# EAGLE design AeroQuad_v300 (EAGLE 6.4)
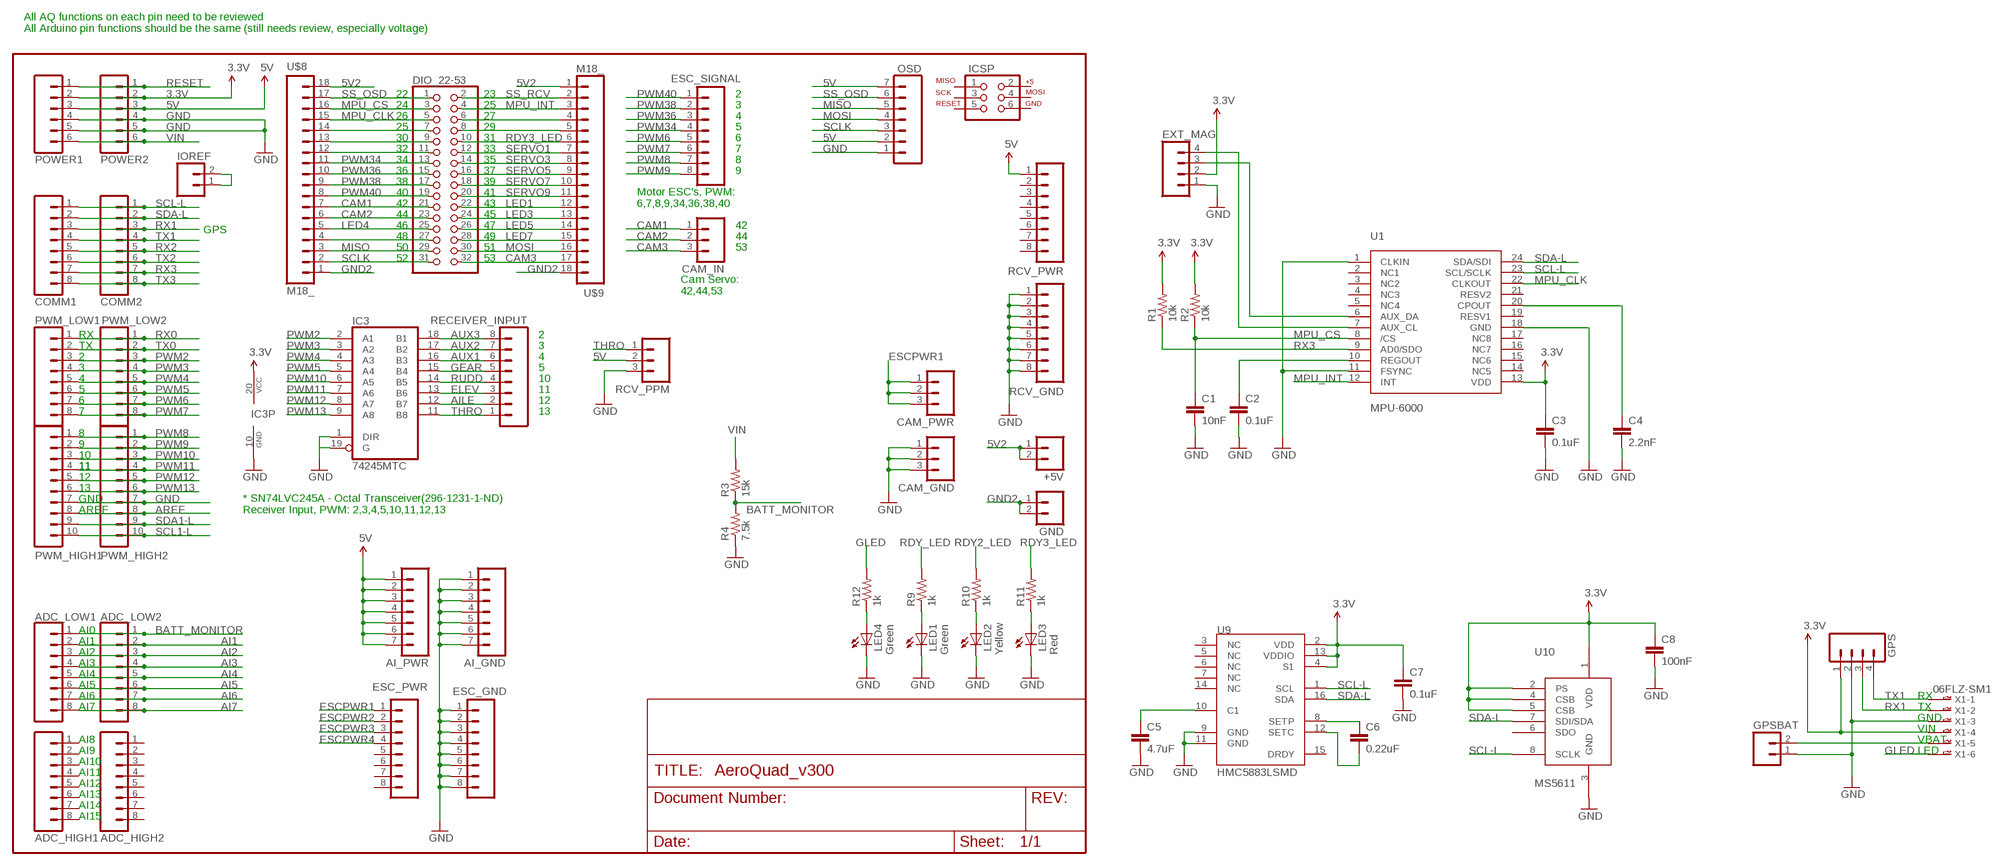
[diagram p0: schematic, sheet 1]

## Parts
+5V  M02PTH  [1X02]
ADC_HIGH1  M08LOCK  [1X08_LOCK]
ADC_HIGH2  M08LOCK  [1X08_LOCK]
ADC_LOW1  M08LOCK  [1X08_LOCK]
ADC_LOW2  M08LOCK  [1X08_LOCK]
AI_GND  M07  [1X07]
AI_PWR  M07  [1X07]
C1  10nF  CAP0402-CAP  [0402-CAP]
C2  0.1uF  CAP0402-CAP  [0402-CAP]
C3  0.1uF  CAP0402-CAP  [0402-CAP]
C4  2.2nF  CAP0402-CAP  [0402-CAP]
C5  4.7uF  CAP0402-CAP  [0402-CAP]
C6  0.22uF  CAP0402-CAP  [0402-CAP]
C7  0.1uF  CAP0402-CAP  [0402-CAP]
C8  100nF  CAP0402-CAP  [0402-CAP]
CAM_GND  M03LOCK  [1X03_LOCK]
CAM_IN  M03LOCK  [1X03_LOCK]
CAM_PWR  M03LOCK  [1X03_LOCK]
COMM1  M08LOCK  [1X08_LOCK]
COMM2  M08LOCK  [1X08_LOCK]
DIO_22-53  PINHD-2X16  [2X16]
ESC_GND  M11LOCK  M08LOCK  [1X08_LOCK]
ESC_PWR  M11LOCK  M08LOCK  [1X08_LOCK]
ESC_SIGNAL  M11LOCK  M08LOCK  [1X08_LOCK]
EXT_MAG  M04LOCK  [1X04_LOCK]
GND  M02PTH  [1X02]
GPS  M04LOCK  [1X04_LOCK]
GPSBAT  M02PTH  [1X02]
IC3  74245MTC  [SSOP20]
ICSP  AVR_SPI_PRG_6NS  [2X3-NS]
IOREF  M02LOCK  [1X02_LOCK]
LED1  Green  LED0603  [LED-0603]
LED2  Yellow  LED0603  [LED-0603]
LED3  Red  LED0603  [LED-0603]
LED4  Green  LED0603  [LED-0603]
OSD  M07LOCK  [1X07_LOCK]
POWER1  M06LOCK  [1X06_LOCK]
POWER2  M06LOCK  [1X06_LOCK]
PWM_HIGH1  M10LOCK  [1X10_LOCK]
PWM_HIGH2  M10LOCK  [1X10_LOCK]
PWM_LOW1  M08LOCK  [1X08_LOCK]
PWM_LOW2  M08LOCK  [1X08_LOCK]
R1  10k  RESISTOR0402-RES  [0402-RES]
R2  10k  RESISTOR0402-RES  [0402-RES]
R3  15k  RESISTOR0402-RES  [0402-RES]
R4  7.5k  RESISTOR0402-RES  [0402-RES]
R9  1k  RESISTOR0402-RES  [0402-RES]
R10  1k  RESISTOR0402-RES  [0402-RES]
R11  1k  RESISTOR0402-RES  [0402-RES]
R12  1k  RESISTOR0402-RES  [0402-RES]
RCV_GND  M10LOCK  M08LOCK  [1X08_LOCK]
RCV_PPM  M03LOCK  [1X03_LOCK]
RCV_PWR  M10LOCK  M08LOCK  [1X08_LOCK]
RECEIVER_INPUT  M08LOCK  [1X08_LOCK]
U1  MPU-6000  [QFN-24]
U9  HMC5883LSMD  [16LPCC]
U10  MS5611  [LGA08A]
U$8  M18_  [1X18]
U$9  M18_  [1X18]
X1  06FLZ-SM1  [6FLZ-SM]

## Nets
3.3V: C3.1 C7.1 C8.1 EXT_MAG.2 GPS.1 IC3.20(VCC) POWER1.2 POWER2.2 R1.2 R2.2 U1.13(VDD) U9.2(VDD) U9.4(S1) U9.13(VDDIO) U10.1(VDD) U10.2(PS) U10.4(CSB) U10.5(CSB) X1.4
5V: AI_PWR.1 AI_PWR.2 AI_PWR.3 AI_PWR.4 AI_PWR.5 AI_PWR.6 AI_PWR.7 OSD.2 OSD.7 POWER1.3 POWER2.3 RCV_PPM.2 RCV_PWR.1
5V2: +5V.1 +5V.2 U$8.18 U$9.1
AI1: ADC_LOW1.2 ADC_LOW2.2
AI2: ADC_LOW1.3 ADC_LOW2.3
AI3: ADC_LOW1.4 ADC_LOW2.4
AI4: ADC_LOW1.5 ADC_LOW2.5
AI5: ADC_LOW1.6 ADC_LOW2.6
AI6: ADC_LOW1.7 ADC_LOW2.7
AI7: ADC_LOW1.8 ADC_LOW2.8
AILE: IC3.12(B7) RECEIVER_INPUT.2
AREF: PWM_HIGH1.8 PWM_HIGH2.8
AUX1: IC3.16(B3) RECEIVER_INPUT.6
AUX2: IC3.17(B2) RECEIVER_INPUT.7
AUX3: IC3.18(B1) RECEIVER_INPUT.8
BATT_MONITOR: ADC_LOW1.1 ADC_LOW2.1 R3.1 R4.2
CAM1: CAM_IN.1 DIO_22-53.21 U$8.7
CAM2: CAM_IN.2 DIO_22-53.23 U$8.6
CAM3: CAM_IN.3 DIO_22-53.32 U$9.17
ELEV: IC3.13(B6) RECEIVER_INPUT.3
ESCPWR1: CAM_PWR.1 CAM_PWR.2 CAM_PWR.3 ESC_PWR.1
ESCPWR2: ESC_PWR.2
ESCPWR3: ESC_PWR.3
ESCPWR4: ESC_PWR.4
GEAR: IC3.15(B4) RECEIVER_INPUT.5
GLED: R12.2 X1.6
GND: AI_GND.1 AI_GND.2 AI_GND.3 AI_GND.4 AI_GND.5 AI_GND.6 AI_GND.7 C1.2 C2.2 C3.2 C4.2 C5.2 C7.2 C8.2 CAM_GND.1 CAM_GND.2 CAM_GND.3 ESC_GND.1 ESC_GND.2 ESC_GND.3 ESC_GND.4 ESC_GND.5 ESC_GND.6 ESC_GND.7 ESC_GND.8 EXT_MAG.1 GPS.2 GPSBAT.1 IC3.1(DIR) IC3.10(GND) IC3.19(G) LED1.C LED2.C LED3.C LED4.C OSD.1 POWER1.4 POWER1.5 POWER2.4 POWER2.5 PWM_HIGH1.7 PWM_HIGH2.7 R4.1 RCV_GND.1 RCV_GND.2 RCV_GND.3 RCV_GND.4 RCV_GND.5 RCV_GND.6 RCV_GND.7 RCV_GND.8 RCV_PPM.3 U1.1(CLKIN) U1.11(FSYNC) U1.18(GND) U9.9(GND) U9.11(GND) U10.3(GND) X1.3
GND2: GND.1 GND.2 U$8.1 U$9.18
LED1: DIO_22-53.22 U$9.12
LED3: DIO_22-53.24 U$9.13
LED4: DIO_22-53.25 U$8.5
LED5: DIO_22-53.26 U$9.14
LED7: DIO_22-53.28 U$9.15
MISO: DIO_22-53.29 OSD.5 U$8.3
MOSI: DIO_22-53.30 OSD.4 U$9.16
MPU_CLK: DIO_22-53.5 U1.22(CLKOUT) U$8.15
MPU_CS: C1.1 DIO_22-53.3 R2.1 U1.8(/CS) U$8.16
MPU_INT: DIO_22-53.4 U1.12(INT) U$9.3
N$1: DIO_22-53.11 U$8.12
N$2: DIO_22-53.9 U$8.13
N$3: DIO_22-53.7 U$8.14
N$4: LED4.A R12.1
N$5: DIO_22-53.27 U$8.4
N$8: GPSBAT.2 X1.5
N$10: LED1.A R9.1
N$11: LED2.A R10.1
N$12: LED3.A R11.1
N$13: C5.1 U9.10(C1)
N$14: EXT_MAG.4 U1.7(AUX_CL)
N$15: EXT_MAG.3 U1.6(AUX_DA)
N$17: IOREF.1 IOREF.2
N$20: C6.1 U9.8(SETP)
N$22: C6.2 U9.12(SETC)
N$33: C2.1 U1.10(REGOUT)
N$37: DIO_22-53.6 U$9.4
N$38: DIO_22-53.8 U$9.5
N$40: C4.1 U1.20(CPOUT)
PWM2: IC3.2(A1) PWM_LOW1.3 PWM_LOW2.3
PWM3: IC3.3(A2) PWM_LOW1.4 PWM_LOW2.4
PWM4: IC3.4(A3) PWM_LOW1.5 PWM_LOW2.5
PWM5: IC3.5(A4) PWM_LOW1.6 PWM_LOW2.6
PWM6: ESC_SIGNAL.5 PWM_LOW1.7 PWM_LOW2.7
PWM7: ESC_SIGNAL.6 PWM_LOW1.8 PWM_LOW2.8
PWM8: ESC_SIGNAL.7 PWM_HIGH1.1 PWM_HIGH2.1
PWM9: ESC_SIGNAL.8 PWM_HIGH1.2 PWM_HIGH2.2
PWM10: IC3.6(A5) PWM_HIGH1.3 PWM_HIGH2.3
PWM11: IC3.7(A6) PWM_HIGH1.4 PWM_HIGH2.4
PWM12: IC3.8(A7) PWM_HIGH1.5 PWM_HIGH2.5
PWM13: IC3.9(A8) PWM_HIGH1.6 PWM_HIGH2.6
PWM34: DIO_22-53.13 ESC_SIGNAL.4 U$8.11
PWM36: DIO_22-53.15 ESC_SIGNAL.3 U$8.10
PWM38: DIO_22-53.17 ESC_SIGNAL.2 U$8.9
PWM40: DIO_22-53.19 ESC_SIGNAL.1 U$8.8
RDY2_LED: R10.2
RDY3_LED: DIO_22-53.10 R11.2 U$9.6
RDY_LED: R9.2
RESET: POWER1.1 POWER2.1
RUDD: IC3.14(B5) RECEIVER_INPUT.4
RX0: PWM_LOW1.1 PWM_LOW2.1
RX1: COMM1.3 COMM2.3 GPS.3 X1.2
RX2: COMM1.5 COMM2.5
RX3: COMM1.7 COMM2.7 R1.1 U1.9(AD0/SDO)
SCL1-L: PWM_HIGH1.10 PWM_HIGH2.10
SCL-L: COMM1.1 COMM2.1 U1.23(SCL/SCLK) U9.1(SCL) U10.8(SCLK)
SCLK: DIO_22-53.31 OSD.3 U$8.2
SDA1-L: PWM_HIGH1.9 PWM_HIGH2.9
SDA-L: COMM1.2 COMM2.2 U1.24(SDA/SDI) U9.16(SDA) U10.7(SDI/SDA)
SERVO1: DIO_22-53.12 U$9.7
SERVO3: DIO_22-53.14 U$9.8
SERVO5: DIO_22-53.16 U$9.9
SERVO7: DIO_22-53.18 U$9.10
SERVO9: DIO_22-53.20 U$9.11
SS_OSD: DIO_22-53.1 OSD.6 U$8.17
SS_RCV: DIO_22-53.2 U$9.2
THRO: IC3.11(B8) RCV_PPM.1 RECEIVER_INPUT.1
TX0: PWM_LOW1.2 PWM_LOW2.2
TX1: COMM1.4 COMM2.4 GPS.4 X1.1
TX2: COMM1.6 COMM2.6
TX3: COMM1.8 COMM2.8
VIN: POWER1.6 POWER2.6 R3.2
Unconnected: ADC_HIGH1.1 ADC_HIGH1.2 ADC_HIGH1.3 ADC_HIGH1.4 ADC_HIGH1.5 ADC_HIGH1.6 ADC_HIGH1.7 ADC_HIGH1.8 ADC_HIGH2.1 ADC_HIGH2.2 ADC_HIGH2.3 ADC_HIGH2.4 ADC_HIGH2.5 ADC_HIGH2.6 ADC_HIGH2.7 ADC_HIGH2.8 ESC_PWR.5 ESC_PWR.6 ESC_PWR.7 ESC_PWR.8 ICSP.1 ICSP.2 ICSP.3 ICSP.4 ICSP.5 ICSP.6 RCV_PWR.2 RCV_PWR.3 RCV_PWR.4 RCV_PWR.5 RCV_PWR.6 RCV_PWR.7 RCV_PWR.8 U1.2(NC1) U1.3(NC2) U1.4(NC3) U1.5(NC4) U1.14(NC5) U1.15(NC6) U1.16(NC7) U1.17(NC8) U1.19(RESV1) U1.21(RESV2) U9.3(NC) U9.5(NC) U9.6(NC) U9.7(NC) U9.14(NC) U9.15(DRDY) U10.6(SDO)

## Notes on the sheet
- All AQ functions on each pin need to be reviewed
  All Arduino pin functions should be the same (still needs review, especially voltage)
- 22 | 23 | 2
- 24 | 25 | 3
- 26 | 27 | 4
- 25 | 29 | 5
- 30 | 31 | 6
- 32 | 33 | 7
- 34 | 35 | 8
- 36 | 37 | 9
- 38 | 39
- 40 | 41
- 42 | 43
- Motor ESC's, PWM:
  6,7,8,9,34,36,38,40
- 44 | 45
- 46 | 47 | 42
- GPS
- 48 | 49 | 44
- 50 | 51 | 53
- 52 | 53
- Cam Servo:
  42,44,53
- RX | 2
- TX | 3
- 2 | 4
- 3 | 5
- 4 | 10
- 5 | 11
- 6 | 12
- 7 | 13
- 8
- 9
- 10
- 11 | 11
- 12
- 13
- GND
- AREF
- * SN74LVC245A - Octal Transceiver(296-1231-1-ND)
  Receiver Input, PWM: 2,3,4,5,10,11,12,13
- AI0
- AI1
- AI2
- AI3
- AI4
- AI5
- AI6 | RX
- AI7 | TX
- GND
- VIN
- AI8 | VBAT
- AI9 | LED
- AI10
- AI11
- AI12
- AI13
- AI14
- AI15

## Library data of the parts
+5V GND GPSBAT IOREF = SparkFun:M02: Header 2 Standard 2-pin 0.1" header. Use with straight break away headers (SKU : PRT-00116), right angle break away headers (PRT-00553), swiss pins (PRT-00743), machine pins (PRT-00117), and female headers (PRT-00115). Molex polarized connector foot print use with SKU : PRT-08233 with associated crimp pins and housings.
ADC_HIGH1 ADC_HIGH2 ADC_LOW1 ADC_LOW2 COMM1 COMM2 ESC_GND ESC_PWR ESC_SIGNAL PWM_LOW1 PWM_LOW2 RCV_GND RCV_PWR RECEIVER_INPUT = SparkFun:M08: Header 8 Standard 8-pin 0.1" header. Use with straight break away headers (SKU : PRT-00116), right angle break away headers (PRT-00553), swiss pins (PRT-00743), machine pins (PRT-00117), and female headers (PRT-00115).
AI_GND AI_PWR OSD = SparkFun:M07: Header 7 Standard 7-pin 0.1" header. Use with straight break away headers (SKU : PRT-00116), right angle break away headers (PRT-00553), swiss pins (PRT-00743), machine pins (PRT-00117), and female headers (PRT-00115). NOTES ON THE VARIANTS LOCK and LOCK_LONGPADS... This footprint was designed to help hold the alignment of a through-hole component (i.e. 7-pin header) while soldering it into place. You may notice that each hole has been shifted either up or down by 0.005 of an inch from it's more standard position (which is usually a perfectly straight line). This slight alteration caused the pins (the squares in the middle) to touch the edges of the holes. Because they are alternating, it causes a "brace" to hold the header in place. 0.005 has proven to be the perfect amount of "off-center" position when using our standard breakaway headers. Although looks a little odd when you look at the bare footprint, once you have a header in there, the alteration is very hard to notice. Also, if you push a header all the way into place, it is covered up entirely on the bottom side. This idea of altering the position of holes to aid alignment will be further integrated into the Sparkfun Library for other footprints. It can help hold any component with 3 or more connection pins.
C1-C8 = SparkFun:CAP: Capacitor Standard 0603 ceramic capacitor, and 0.1" leaded capacitor.
CAM_GND CAM_IN CAM_PWR RCV_PPM = SparkFun:M03: Header 3 Standard 3-pin 0.1" header. Use with straight break away headers (SKU : PRT-00116), right angle break away headers (PRT-00553), swiss pins (PRT-00743), machine pins (PRT-00117), and female headers (PRT-00115). Molex polarized connector foot print use with SKU : PRT-08232 with associated crimp pins and housings.
DIO_22-53 = pinhead:PINHD-2X16: PIN HEADER
EXT_MAG GPS = SparkFun:M04: Header 4 Standard 4-pin 0.1" header. Use with straight break away headers (SKU : PRT-00116), right angle break away headers (PRT-00553), swiss pins (PRT-00743), machine pins (PRT-00117), and female headers (PRT-00115). Molex polarized connector foot print use with SKU : PRT-08231 with associated crimp pins and housings. 1MM SMD Version SKU: PRT-10208
IC3 = adafruit:74*245: Octal BUS TRANSCEIVER, 3-state
ICSP = SparkFun:AVR_SPI_PRG_6: AVR ISP 6 Pin This is the reduced ISP connector for AVR programming. Common on Arduino. This footprint will take up less PCB space and can be used with a 10-pin to 6-pin adapter such as SKU: BOB-08508
LED1-LED4 = SparkFun:LED: LEDs Standard schematic elements and footprints for 5mm, 3mm, 1206, and 0603 sized LEDs. 5mm - Spark Fun Electronics SKU : COM-00529 (and others)
POWER1 POWER2 = SparkFun:M06: Header 6 Standard 6-pin 0.1" header. Use with straight break away headers (SKU : PRT-00116), right angle break away headers (PRT-00553), swiss pins (PRT-00743), machine pins (PRT-00117), and female headers (PRT-00115). Molex polarized connector foot print use with SKU : PRT-08094 with associated crimp pins and housings. NOTES ON THE VARIANTS LOCK and LOCK_LONGPADS... This footprint was designed to help hold the alignment of a through-hole component (i.e. 6-pin header) while soldering it into place. You may notice that each hole has been shifted either up or down by 0.005 of an inch from it's more standard position (which is a perfectly straight line). This slight alteration caused the pins (the squares in the middle) to touch the edges of the holes. Because they are alternating, it causes a "brace" to hold the component in place. 0.005 has proven to be the perfect amount of "off-center" position when using our standard breakaway headers. Although looks a little odd when you look at the bare footprint, once you have a header in there, the alteration is very hard to notice. Also, if you push a header all the way into place, it is covered up entirely on the bottom side. This idea of altering the position of holes to aid alignment will be further integrated into the Sparkfun Library for other footprints. It can help hold any component with 3 or more connection pins.
PWM_HIGH1 PWM_HIGH2 = SparkFun:M10: Header 10 Standard 10-pin 0.1" header. Use with straight break away headers (SKU : PRT-00116), right angle break away headers (PRT-00553), swiss pins (PRT-00743), machine pins (PRT-00117), and female headers (PRT-00115).
R1-R4 R9-R12 = SparkFun:RESISTOR: Resistor Basic schematic elements and footprints for 0603, 1206, and PTH resistors.
U1 = 3DRobotics_Master_Library:MPU-6000: Invensense MPU-6000: 3-axis gyro, 3-axis accel & 9-axis MotionFusion The MPU-60X0 Motion Processing Unit (MPU?) is the world?s first motion processing solution with integrated 9-axis sensor fusion for handset and tablet applications, game controllers, motion pointer remote controls, and other consumer devices. The MPU-60X0 has an embedded 3-axis MEMS gyroscope, 3-axis MEMS accelerometer and Digital Motion Processor? (DMP) hardware accelerator engine with an auxiliary I 2 C port that interfaces to third party digital sensors, such as magnetometers. Interfacing with a 3-axis magnetometer delivers a complete 9-axis sensor fusion output to the MPU?s primary I 2 C or SPI port. (SPI is available on MPU-6000 only). This combines acceleration and rotational motion plus heading information into a single data stream for the application; DATASHEET: http://invensense.com/mems/gyro/documents/PS-MPU-6000A-00_v1.0.pdf; LINK: http://invensense.com/mems/gyro/mpu6000.html; MFGPN: MPU-6000
U9 = SparkFun:HMC5883L: 3 Axis Digital Compass IC
U10 = DSP-TI:MS5611: Pressure sensor 10cm
U$8 U$9 = SparkFun:M18
X1 = con-jst:06FLZ-SM1: CONNECTOR; OC_FARNELL: unknown; OC_NEWARK: unknown

## Net classes
0 default: width 0.203 mm
1 vcc: width 0.254 mm

## Board
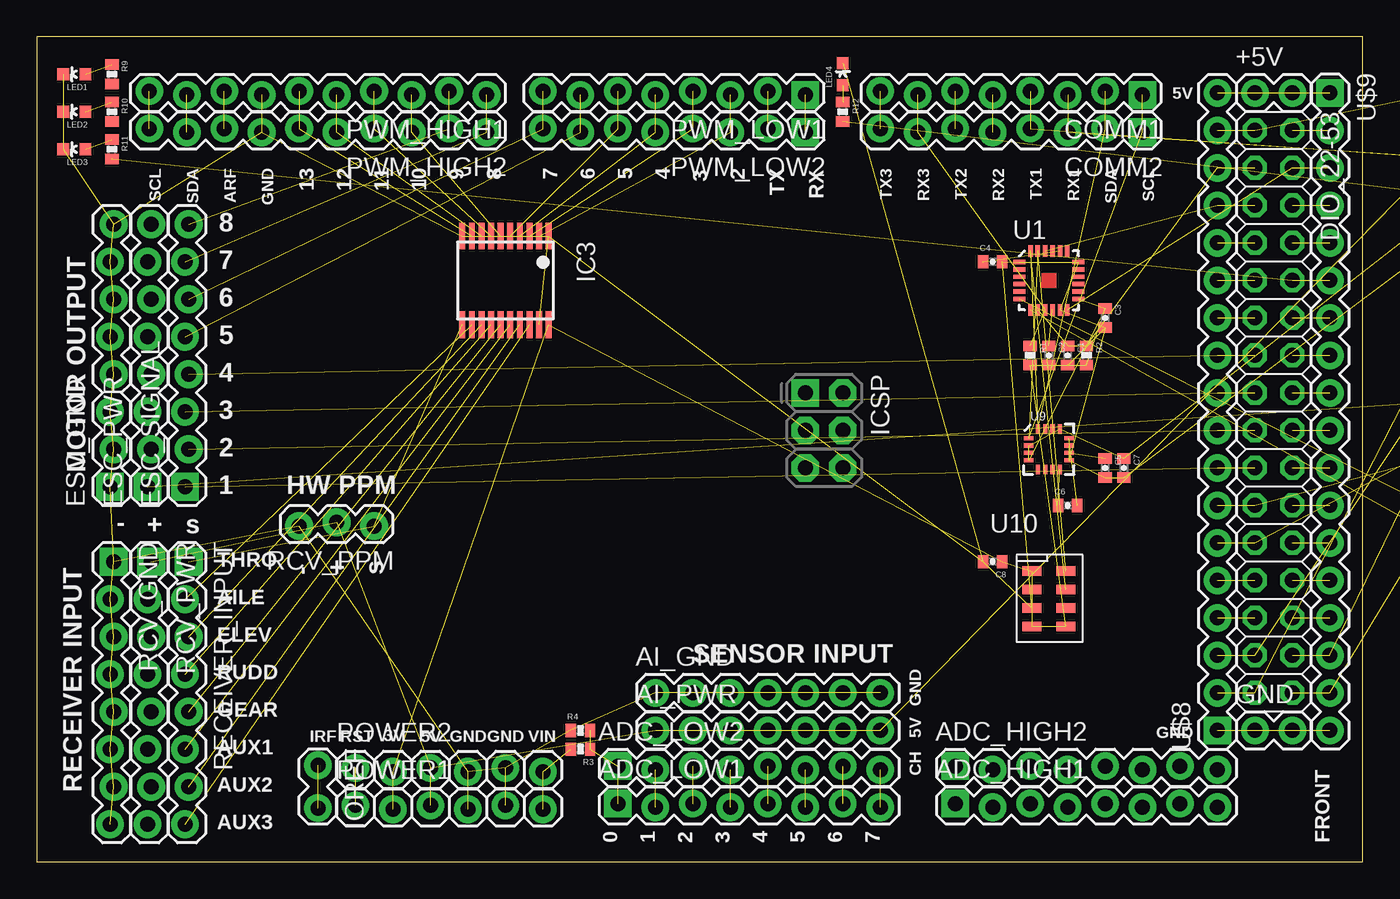
[diagram p1: board, top side]
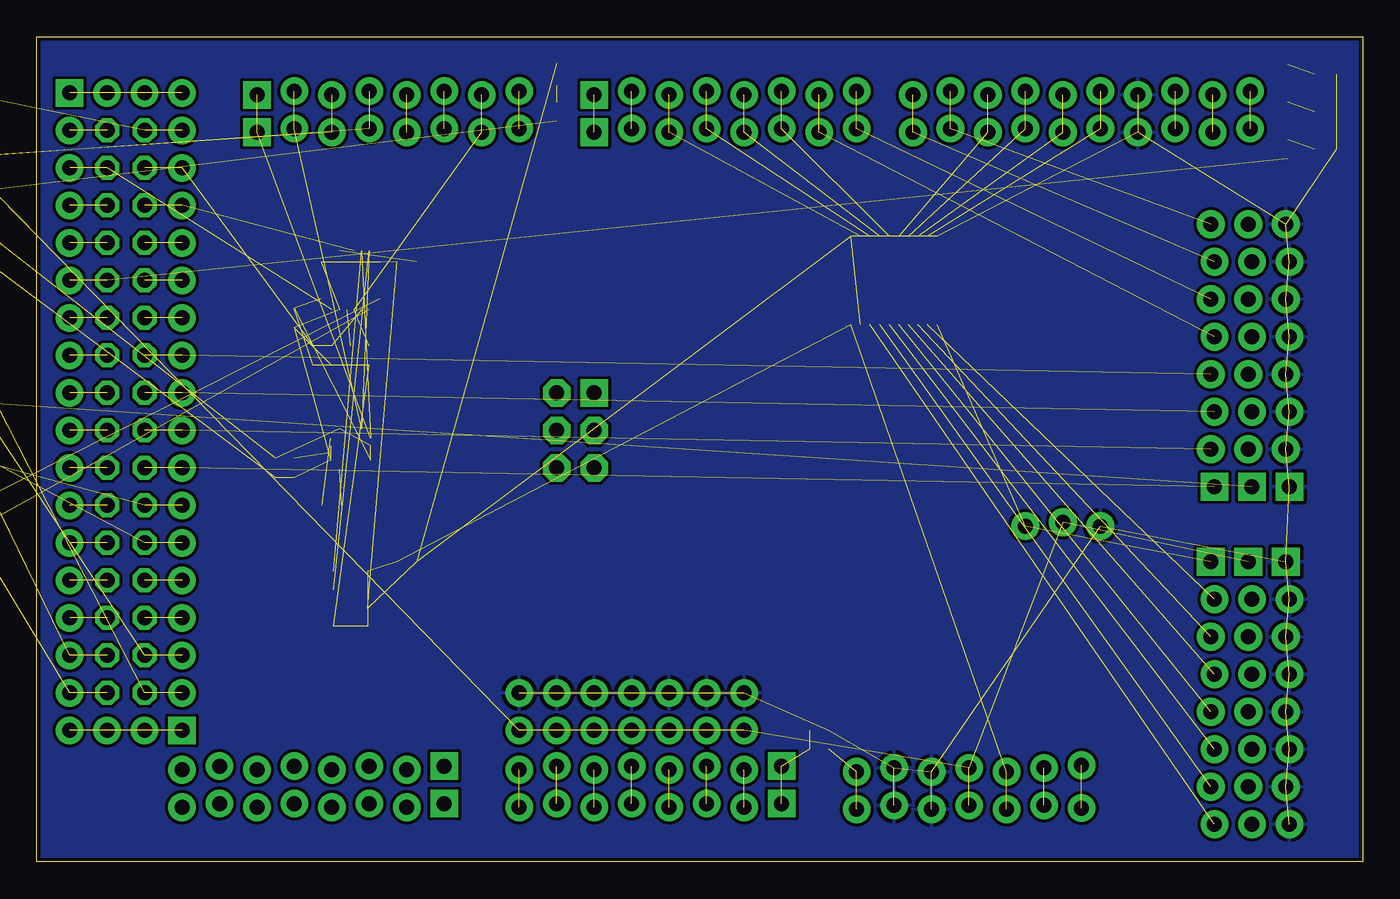
[diagram p2: board, bottom side, seen from below]

Size 89.84 x 55.87 mm. Coordinates in mm from the lower left corner, seen from the top.
Outline: 0,0 89.84,0 89.84,55.87 0,55.87 0,0
Copper layers (1*16): Top 0.035mm / dielectric 1.5mm / Bottom 0.035mm
Design rules "default": minimum track width 8mil, minimum drill 20mil, track to track 8mil, track to pad 8mil, pad to pad 8mil, via to via 8mil, smd to smd 8mil, copper to edge 10mil, drill to drill 8mil, minimum pad ring 12mil, minimum via ring 10mil, stop-mask expansion 4mil, vias tented up to drill 25mil, thermal gap 10mil

### Footprints (pad centres in the part's own frame; a part is rotated, then mirrored left to right if it is on the bottom)
1X02 = drill 1.016 pad 1.88: 1 0,0; 2 2.54,0
1X08_LOCK = drill 1.016 pad 1.88 square: 1 0,0.127 | drill 1.016 pad 1.88: 2 2.54,-0.127; 3 5.08,0.127; 4 7.62,-0.127; 5 10.16,0.127; 6 12.7,-0.127; 7 15.24,0.127; 8 17.78,-0.127
1X07 = drill 1.016 pad 1.88: 1 0,0; 2 2.54,0; 3 5.08,0; 4 7.62,0; 5 10.16,0; 6 12.7,0; 7 15.24,0
0402-CAP = smd 0.7 x 0.9: 1 -0.65,0; 2 0.65,0
1X03_LOCK = drill 1.016 pad 1.88: 1 0,0.127; 2 2.54,-0.127; 3 5.08,0.127
2X16 = drill 1.016 octagon: 1 -19.05,-1.27; 2 -19.05,1.27; 3 -16.51,-1.27; 4 -16.51,1.27; 5 -13.97,-1.27; 6 -13.97,1.27; 7 -11.43,-1.27; 8 -11.43,1.27; 9 -8.89,-1.27; 10 -8.89,1.27; 11 -6.35,-1.27; 12 -6.35,1.27; 13 -3.81,-1.27; 14 -3.81,1.27; 15 -1.27,-1.27; 16 -1.27,1.27; 17 1.27,-1.27; 18 1.27,1.27; 19 3.81,-1.27; 20 3.81,1.27; 21 6.35,-1.27; 22 6.35,1.27; 23 8.89,-1.27; 24 8.89,1.27; 25 11.43,-1.27; 26 11.43,1.27; 27 13.97,-1.27; 28 13.97,1.27; 29 16.51,-1.27; 30 16.51,1.27; 31 19.05,-1.27; 32 19.05,1.27
1X04_LOCK = drill 1.016 pad 1.88 square: 1 0,0.127 | drill 1.016 pad 1.88: 2 2.54,-0.127; 3 5.08,0.127; 4 7.62,-0.127
SSOP20 = smd 0.4 x 1.8: 1 -2.925,-3; 2 -2.275,-3; 3 -1.625,-3; 4 -0.975,-3; 5 -0.325,-3; 6 0.325,-3; 7 0.975,-3; 8 1.625,-3; 9 2.275,-3; 10 2.925,-3; 11 2.925,3; 12 2.275,3; 13 1.625,3; 14 0.975,3; 15 0.325,3; 16 -0.325,3; 17 -0.975,3; 18 -1.625,3; 19 -2.275,3; 20 -2.925,3
2X3-NS = drill 1.016 pad 1.88 square: 1 -2.54,-1.27 | drill 1.016 pad 1.88 octagon: 2 -2.54,1.27; 3 0,-1.27; 4 0,1.27; 5 2.54,-1.27; 6 2.54,1.27
1X02_LOCK = drill 1.016 pad 1.88: 1 -0.178,0; 2 2.718,0
LED-0603 = smd 0.8 x 0.8: A 0,-0.75; C 0,0.75
1X07_LOCK = drill 1.016 pad 1.88: 1 0,0.127; 2 2.54,-0.127; 3 5.08,0.127; 4 7.62,-0.127; 5 10.16,0.127; 6 12.7,-0.127; 7 15.24,0.127
1X06_LOCK = drill 1.016 pad 1.88: 1 0,0; 2 2.54,-0.254; 3 5.08,0; 4 7.62,-0.254; 5 10.16,0; 6 12.7,-0.254
1X10_LOCK = drill 1.016 pad 1.88: 1 0,0.127; 2 2.54,-0.127; 3 5.08,0.127; 4 7.62,-0.127; 5 10.16,0.127; 6 12.7,-0.127; 7 15.24,0.127; 8 17.78,-0.127; 9 20.32,0.127; 10 22.86,-0.127
0402-RES = smd 0.7 x 0.9: 1 -0.65,0; 2 0.65,0
QFN-24 = smd 0.8 x 0.3: 1 -2,1.25; 2 -2,0.75; 3 -2,0.25; 4 -2,-0.25; 5 -2,-0.75; 6 -2,-1.25; 13 2,-1.25; 14 2,-0.75; 15 2,-0.25; 16 2,0.25; 17 2,0.75; 18 2,1.25 | smd 0.3 x 0.8: 7 -1.25,-2; 8 -0.75,-2; 9 -0.25,-2; 10 0.25,-2; 11 0.75,-2; 12 1.25,-2; 19 1.25,2; 20 0.75,2; 21 0.25,2; 22 -0.25,2; 23 -0.75,2; 24 -1.25,2
16LPCC = smd 0.65 x 0.28: 1 -1.37,0.75; 2 -1.37,0.25; 3 -1.37,-0.25; 4 -1.37,-0.75; 9 1.37,-0.75; 10 1.37,-0.25; 11 1.37,0.25; 12 1.37,0.75 | smd 0.28 x 0.65: 5 -0.75,-1.37; 6 -0.25,-1.37; 7 0.25,-1.37; 8 0.75,-1.37; 13 0.75,1.37; 14 0.25,1.37; 15 -0.25,1.37; 16 -0.75,1.37
LGA08A = smd 1.27 x 0.635: 1 -1.15,1.9; 2 -1.15,0.65; 3 -1.15,-0.6; 4 -1.15,-1.85; 5 1.15,-1.85; 6 1.15,-0.6; 7 1.15,0.65; 8 1.15,1.9
1X18 = drill 1.016 pad 1.88 square: 1 0,0 | drill 1.016 pad 1.88: 2 2.54,0; 3 5.08,0; 4 7.62,0; 5 10.16,0; 6 12.7,0; 7 15.24,0; 8 17.78,0; 9 20.32,0; 10 22.86,0; 11 25.4,0; 12 27.94,0; 13 30.48,0; 14 33.02,0; 15 35.56,0; 16 38.1,0; 17 40.64,0; 18 43.18,0
6FLZ-SM = smd 0.3 x 1.5: 1 -1.25,2.5; 2 -0.75,2.5; 3 -0.25,2.5; 4 0.25,2.5; 5 0.75,2.5; 6 1.25,2.5

### Placement (x,y rotation side)
+5V  82.55,52.07 0 top
ADC_HIGH1  62.23,3.81 0 top
ADC_HIGH2  62.23,6.35 0 top
ADC_LOW1  39.37,3.81 0 top
ADC_LOW2  39.37,6.35 0 top
AI_GND  41.91,11.43 0 top
AI_PWR  41.91,8.89 0 top
C1  69.85,34.29 270 top
C2  68.58,34.29 270 top
C3  72.39,36.83 270 top
C4  64.77,40.64 0 top
C5  72.39,26.67 270 top
C6  69.85,24.13 0 top
C7  73.66,26.67 270 top
C8  64.77,20.32 180 top
CAM_GND  106.68,29.21 90 top  (outside the outline)
CAM_IN  101.6,29.21 90 top  (outside the outline)
CAM_PWR  104.14,34.29 270 top  (outside the outline)
COMM1  74.93,52.07 180 top
COMM2  74.93,49.53 180 top
DIO_22-53  83.82,30.48 270 top
ESC_GND  5.08,25.4 90 top
ESC_PWR  7.62,25.4 90 top
ESC_SIGNAL  10.16,25.4 90 top
EXT_MAG  111.76,20.32 270 top  (outside the outline)
GND  82.55,8.89 0 top
GPS  99.06,46.99 0 top  (outside the outline)
GPSBAT  106.68,43.18 180 top  (outside the outline)
IC3  31.75,39.37 180 top
ICSP  53.34,29.21 270 top
IOREF  19.05,6.35 270 top
LED1  2.54,53.34 90 top
LED2  2.54,50.8 90 top
LED3  2.54,48.26 90 top
LED4  54.61,53.34 0 top
OSD  100.33,55.88 0 top  (outside the outline)
POWER1  21.59,3.81 0 top
POWER2  21.59,6.35 0 top
PWM_HIGH1  30.48,52.07 180 top
PWM_HIGH2  30.48,49.53 180 top
PWM_LOW1  52.07,52.07 180 top
PWM_LOW2  52.07,49.53 180 top
R1  67.31,34.29 270 top
R2  71.12,34.29 270 top
R3  36.83,7.62 180 top
R4  36.83,8.89 0 top
R9  5.08,53.34 270 top
R10  5.08,50.8 270 top
R11  5.08,48.26 270 top
R12  54.61,50.8 270 top
RCV_GND  5.08,20.32 270 top
RCV_PPM  22.86,22.86 180 top
RCV_PWR  7.62,20.32 270 top
RECEIVER_INPUT  10.16,20.32 270 top
U1  68.58,39.37 0 top
U9  68.58,27.94 0 top
U10  68.58,17.78 0 top
U$8  80.01,8.89 90 top
U$9  87.63,52.07 270 top
X1  113.03,45.72 180 top  (outside the outline)

### Tracks (layer width: path | path; a pad name or v marks a point on that pad's centre or on a via)
3.3V  (18 unrouted)
5V  (12 unrouted)
5V2  (3 unrouted)
AI1  (1 unrouted)
AI2  (1 unrouted)
AI3  (1 unrouted)
AI4  (1 unrouted)
AI5  (1 unrouted)
AI6  (1 unrouted)
AI7  (1 unrouted)
AILE  (1 unrouted)
AREF  (1 unrouted)
AUX1  (1 unrouted)
AUX2  (1 unrouted)
AUX3  (1 unrouted)
BATT_MONITOR  (3 unrouted)
CAM1  (2 unrouted)
CAM2  (2 unrouted)
CAM3  (2 unrouted)
ELEV  (1 unrouted)
ESCPWR1  (3 unrouted)
GEAR  (1 unrouted)
GLED  (1 unrouted)
GND  (58 unrouted)
  pour Bottom: 0,0 0,55.88 90.17,55.88 90.17,0
GND2  (3 unrouted)
LED1  (1 unrouted)
LED3  (1 unrouted)
LED4  (1 unrouted)
LED5  (1 unrouted)
LED7  (1 unrouted)
MISO  (2 unrouted)
MOSI  (2 unrouted)
MPU_CLK  (2 unrouted)
MPU_CS  (4 unrouted)
MPU_INT  (2 unrouted)
N$1  (1 unrouted)
N$2  (1 unrouted)
N$3  (1 unrouted)
N$4  (1 unrouted)
N$5  (1 unrouted)
N$8  (1 unrouted)
N$10  (1 unrouted)
N$11  (1 unrouted)
N$12  (1 unrouted)
N$13  (1 unrouted)
N$14  (1 unrouted)
N$15  (1 unrouted)
N$17  (1 unrouted)
N$20  (1 unrouted)
N$22  (1 unrouted)
N$33  (1 unrouted)
N$37  (1 unrouted)
N$38  (1 unrouted)
N$40  (1 unrouted)
PWM2  (2 unrouted)
PWM3  (2 unrouted)
PWM4  (2 unrouted)
PWM5  (2 unrouted)
PWM6  (2 unrouted)
PWM7  (2 unrouted)
PWM8  (2 unrouted)
PWM9  (2 unrouted)
PWM10  (2 unrouted)
PWM11  (2 unrouted)
PWM12  (2 unrouted)
PWM13  (2 unrouted)
PWM34  (2 unrouted)
PWM36  (2 unrouted)
PWM38  (2 unrouted)
PWM40  (2 unrouted)
RDY3_LED  (2 unrouted)
RESET  (1 unrouted)
RUDD  (1 unrouted)
RX0  (1 unrouted)
RX1  (3 unrouted)
RX2  (1 unrouted)
RX3  (3 unrouted)
SCL1-L  (1 unrouted)
SCL-L  (4 unrouted)
SCLK  (2 unrouted)
SDA1-L  (1 unrouted)
SDA-L  (4 unrouted)
SERVO1  (1 unrouted)
SERVO3  (1 unrouted)
SERVO5  (1 unrouted)
SERVO7  (1 unrouted)
SERVO9  (1 unrouted)
SS_OSD  (2 unrouted)
SS_RCV  (1 unrouted)
THRO  (2 unrouted)
TX0  (1 unrouted)
TX1  (3 unrouted)
TX2  (1 unrouted)
TX3  (1 unrouted)
VIN  (2 unrouted)

### Text on the board
tPlace: GND | 5V | SCK | DIN | DOUT | CS | RESET | OSD | 5V | 3V | GND | TX-O | RX-I | SCL | SDA | ARF | GND | 13 | 12 | 11 | 10 | 9 | 8 | 7 | 6 | 5 | 4 | 3 | 2 | TX | RX | TX3 | RX3 | TX2 | RX2 | TX1 | RX1 | SDA | SCL | GPS | BATT | 8 | MOTOR OUTPUT | 7 | 6 | 5 | YAW | 4 | ROLL | 3 | Y | PITCH | X | CAMERA | 2 | s | + | - | 1 | HW PPM | - | + | s | RECEIVER INPUT | THRO | GND | - | + | s | 3V | AILE | ELEV | SENSOR INPUT | AUXSDA | RUDD | AUXSCL | GND | GEAR | IRF | RST | 5V | GND | GND | VIN | GND | 3V | 5V | AUX1 | CH | AeroQuad Shield v3.0 | AUX2 | www.AeroQuad.com | AUX3 | 0 | 1 | 2 | 3 | 4 | 5 | 6 | 7 | FRONT